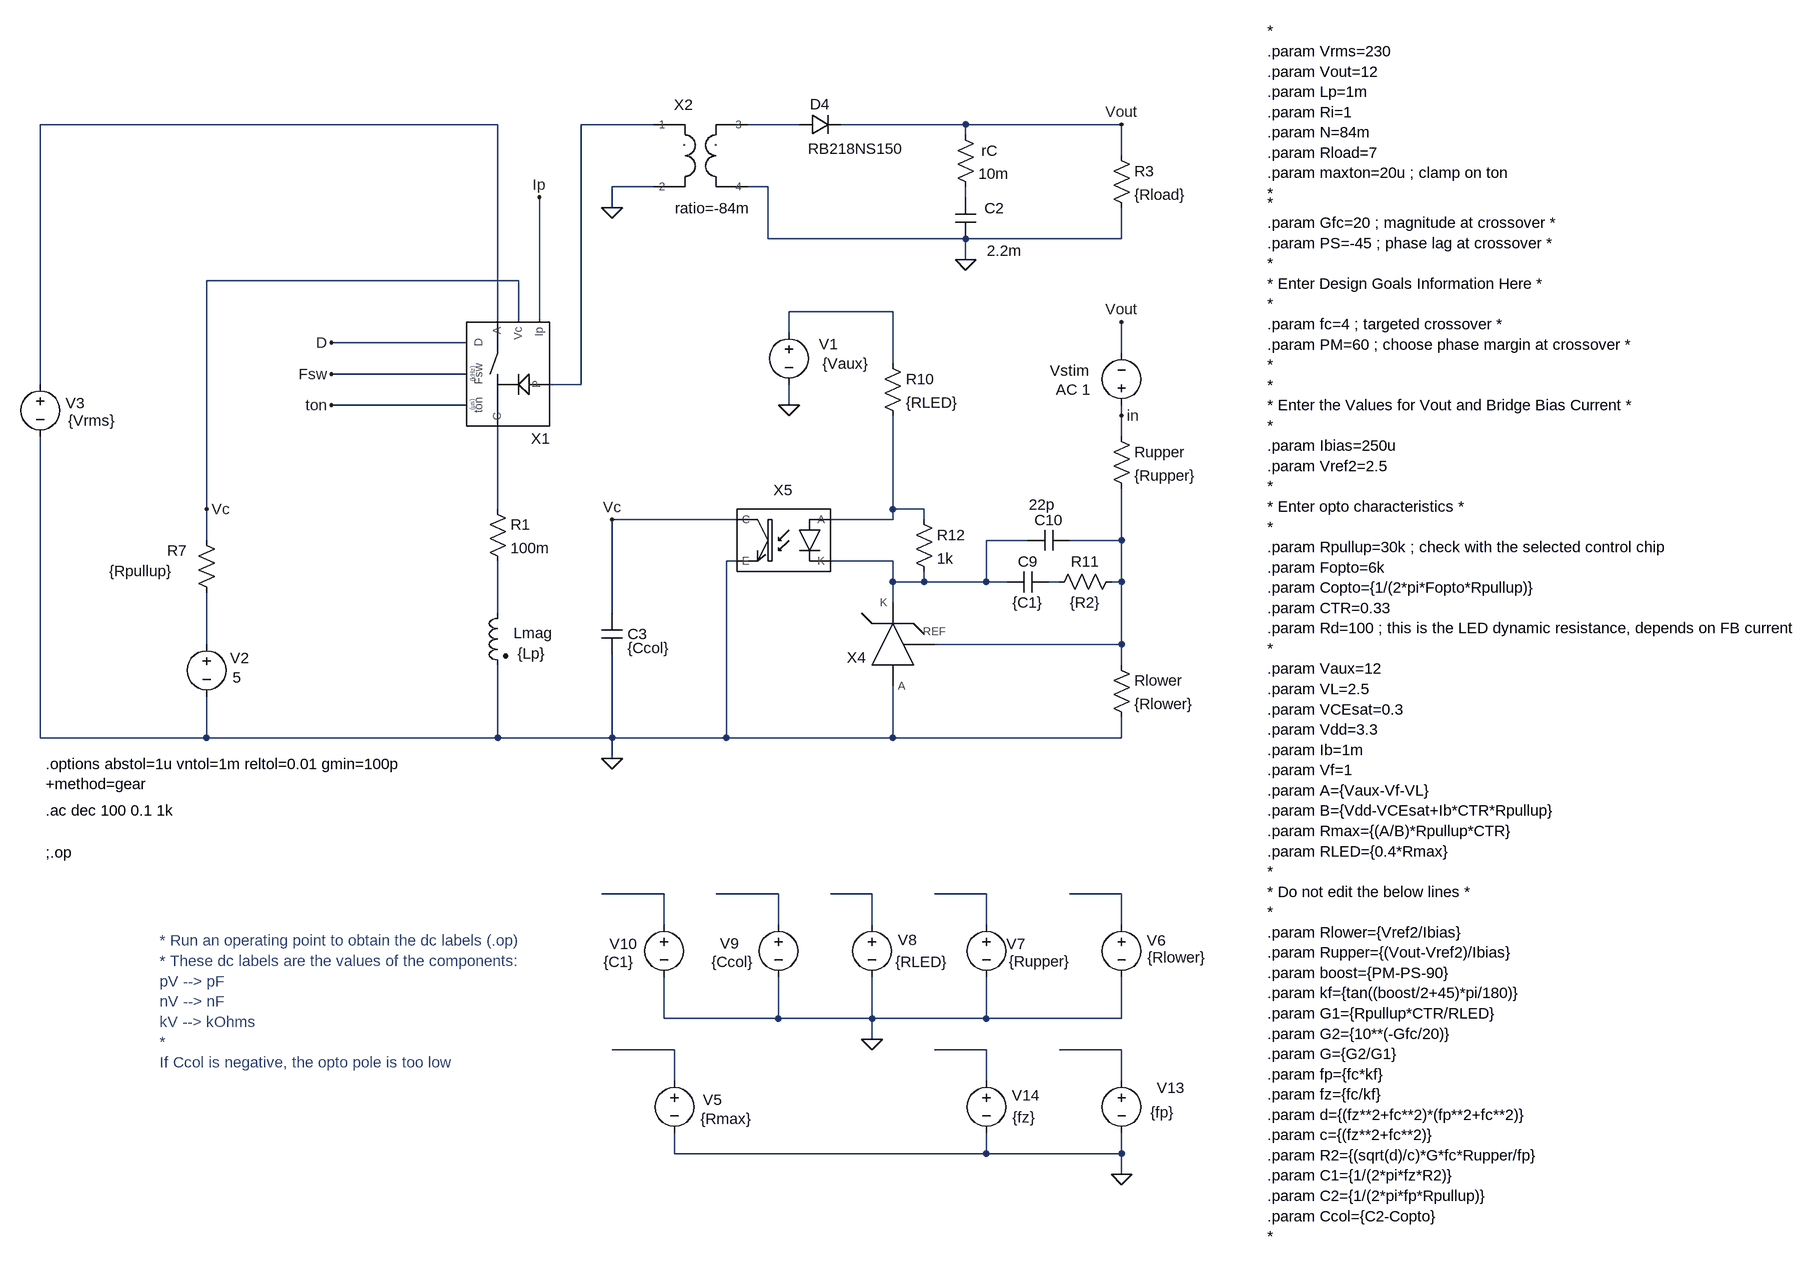
[diagram p0: schematic Flyback CM - QR - isolated single stage - averaged ac.asc]
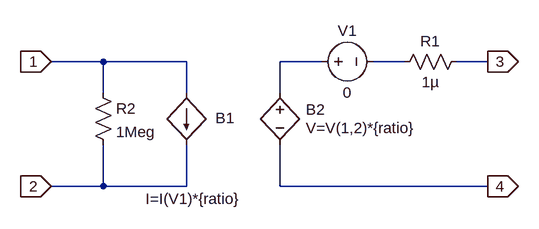
[diagram p1: sub-circuit xfmr.asc]
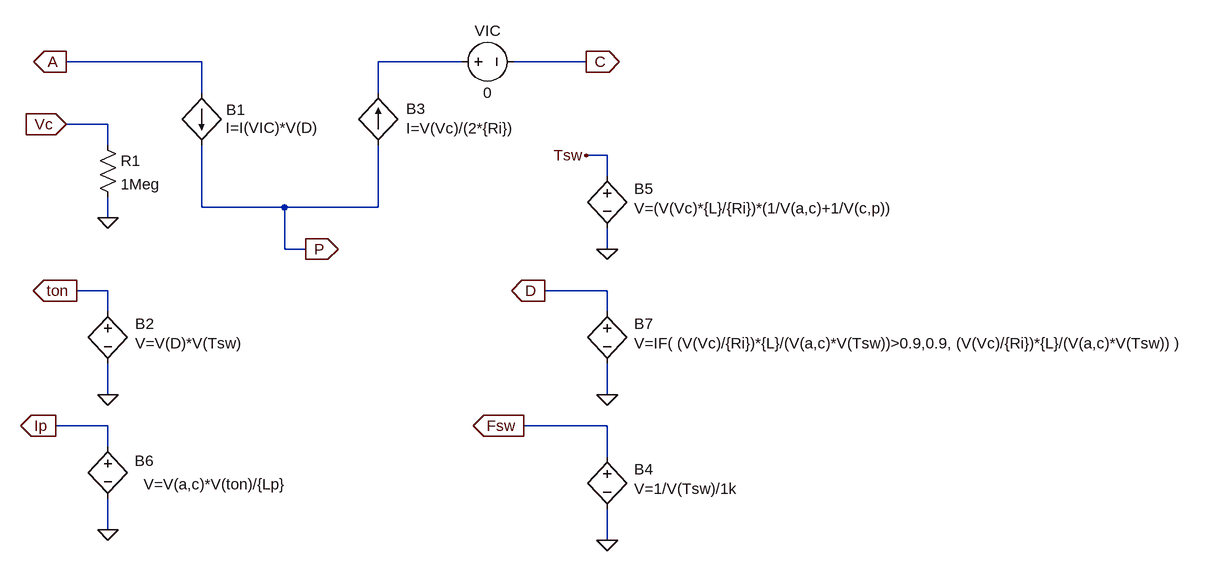
[diagram p2: sub-circuit pwmbcmcm.asc]
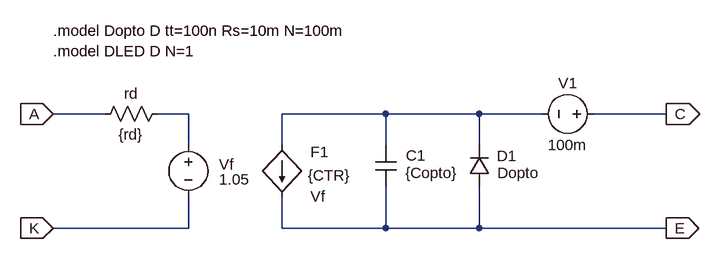
[diagram p3: sub-circuit optotof.asc]
Flyback CM - QR - isolated single stage - averaged ac.asc, the LTspice schematic file:
Version 4.1
SHEET 1 3452 1760
WIRE 16 -208 -688 -208
WIRE 256 -208 144 -208
WIRE 480 -208 400 -208
WIRE 736 -208 544 -208
WIRE 976 -208 736 -208
WIRE 736 -192 736 -208
WIRE 976 -160 976 -208
WIRE 256 -112 192 -112
WIRE 432 -112 400 -112
WIRE 736 -96 736 -112
WIRE 192 -80 192 -112
WIRE 432 -32 432 -112
WIRE 736 -32 432 -32
WIRE 976 -32 976 -80
WIRE 976 -32 736 -32
WIRE 736 0 736 -32
WIRE 48 32 -432 32
WIRE 624 80 464 80
WIRE 16 96 16 -208
WIRE 48 96 48 32
WIRE 80 96 80 -96
WIRE 464 112 464 80
WIRE -32 128 -240 128
WIRE 976 144 976 96
WIRE 624 160 624 80
WIRE -32 176 -240 176
WIRE -688 192 -688 -208
WIRE 144 192 144 -208
WIRE 144 192 96 192
WIRE -32 224 -240 224
WIRE 464 224 464 192
WIRE 976 240 976 224
WIRE 976 272 976 240
WIRE -432 384 -432 32
WIRE 16 384 16 256
WIRE 624 384 624 240
WIRE 672 384 624 384
WIRE 384 400 192 400
WIRE 624 400 624 384
WIRE 624 400 528 400
WIRE 672 400 672 384
WIRE -432 432 -432 384
WIRE 832 432 768 432
WIRE 976 432 976 352
WIRE 976 432 896 432
WIRE 384 464 368 464
WIRE 624 464 528 464
WIRE 624 496 624 464
WIRE 672 496 672 480
WIRE 672 496 624 496
WIRE 768 496 768 432
WIRE 768 496 672 496
WIRE 800 496 768 496
WIRE 880 496 864 496
WIRE 976 496 976 432
WIRE 976 496 960 496
WIRE 624 528 624 496
WIRE 16 544 16 464
WIRE 192 544 192 400
WIRE -432 592 -432 512
WIRE 976 592 976 496
WIRE 976 592 688 592
WIRE 976 624 976 592
WIRE -688 736 -688 272
WIRE -432 736 -432 672
WIRE -432 736 -688 736
WIRE 16 736 16 624
WIRE 16 736 -432 736
WIRE 192 736 192 608
WIRE 192 736 16 736
WIRE 368 736 368 464
WIRE 368 736 192 736
WIRE 624 736 624 656
WIRE 624 736 368 736
WIRE 976 736 976 704
WIRE 976 736 624 736
WIRE 192 768 192 736
WIRE 272 976 176 976
WIRE 448 976 352 976
WIRE 592 976 528 976
WIRE 768 976 688 976
WIRE 976 976 896 976
WIRE 272 1024 272 976
WIRE 448 1024 448 976
WIRE 592 1024 592 976
WIRE 768 1024 768 976
WIRE 976 1024 976 976
WIRE 272 1168 272 1104
WIRE 448 1168 448 1104
WIRE 448 1168 272 1168
WIRE 592 1168 592 1104
WIRE 592 1168 448 1168
WIRE 768 1168 768 1104
WIRE 768 1168 592 1168
WIRE 976 1168 976 1104
WIRE 976 1168 768 1168
WIRE 592 1200 592 1168
WIRE 288 1216 192 1216
WIRE 768 1216 688 1216
WIRE 976 1216 880 1216
WIRE 288 1264 288 1216
WIRE 768 1264 768 1216
WIRE 976 1264 976 1216
WIRE 288 1376 288 1344
WIRE 768 1376 768 1344
WIRE 768 1376 288 1376
WIRE 976 1376 976 1344
WIRE 976 1376 768 1376
WIRE 976 1408 976 1376
FLAG 736 0 0
FLAG 976 -208 Vout
FLAG 192 768 0
FLAG 592 1200 0
FLAG 976 1408 0
FLAG 192 400 Vc
FLAG 976 96 Vout
FLAG 464 224 0
FLAG 192 -80 0
FLAG -432 384 Vc
FLAG -240 128 D
FLAG -240 176 Fsw
FLAG -240 224 ton
FLAG 80 -96 Ip
FLAG 976 240 in
DATAFLAG 192 976 ""
DATAFLAG 384 976 ""
DATAFLAG 560 976 ""
DATAFLAG 704 976 ""
DATAFLAG 928 976 ""
DATAFLAG 896 1216 ""
DATAFLAG 736 1216 ""
DATAFLAG 208 1216 ""
DATAFLAG 736 -208 ""
DATAFLAG 304 400 ""
DATAFLAG 976 432 ""
DATAFLAG -176 128 ""
DATAFLAG -160 176 ""
DATAFLAG -144 224 ""
DATAFLAG 80 0 ""
SYMBOL ind2 32 528 M0
WINDOW 0 -69 47 Left 2
WINDOW 3 -58 78 Left 2
SYMATTR InstName Lmag
SYMATTR Value {Lp}
SYMATTR Type ind
SYMBOL res 720 -208 R0
WINDOW 0 40 40 Left 2
SYMATTR InstName rC
SYMATTR Value 10m
SYMBOL cap 720 -96 R0
WINDOW 0 45 17 Left 2
WINDOW 3 49 82 Left 2
WINDOW 123 45 45 Left 2
SYMATTR InstName C2
SYMATTR Value 2.2m
SYMBOL res 960 -176 R0
SYMATTR InstName R3
SYMATTR Value {Rload}
SYMBOL voltage 976 1008 R0
WINDOW 0 39 40 Left 2
WINDOW 3 40 66 Left 2
WINDOW 123 0 0 Left 0
WINDOW 39 0 0 Left 0
SYMATTR InstName V6
SYMATTR Value {Rlower}
SYMBOL voltage 768 1008 R0
WINDOW 0 31 45 Left 2
WINDOW 3 35 72 Left 2
WINDOW 123 0 0 Left 0
WINDOW 39 0 0 Left 0
SYMATTR InstName V7
SYMATTR Value {Rupper}
SYMBOL voltage 592 1008 R0
WINDOW 0 40 39 Left 2
WINDOW 3 36 73 Left 2
WINDOW 123 0 0 Left 0
WINDOW 39 0 0 Left 0
SYMATTR InstName V8
SYMATTR Value {RLED}
SYMBOL voltage 448 1008 R0
WINDOW 0 -90 44 Left 2
WINDOW 3 -103 73 Left 2
SYMATTR InstName V9
SYMATTR Value {Ccol}
SYMBOL voltage 272 1008 R0
WINDOW 0 -84 45 Left 2
WINDOW 3 -93 73 Left 2
WINDOW 123 0 0 Left 0
WINDOW 39 0 0 Left 0
SYMATTR InstName V10
SYMATTR Value {C1}
SYMBOL voltage 976 1248 R0
WINDOW 0 54 27 Left 2
WINDOW 3 44 64 Left 2
WINDOW 123 0 0 Left 0
WINDOW 39 0 0 Left 0
SYMATTR InstName V13
SYMATTR Value {fp}
SYMBOL voltage 768 1248 R0
WINDOW 0 39 38 Left 2
WINDOW 3 40 72 Left 2
SYMATTR InstName V14
SYMATTR Value {fz}
SYMBOL voltage -432 576 R0
WINDOW 0 36 37 Left 2
WINDOW 3 40 67 Left 2
SYMATTR InstName V2
SYMATTR Value 5
SYMBOL res -448 416 R0
WINDOW 3 -134 63 Left 2
WINDOW 0 -45 32 Left 2
SYMATTR Value {Rpullup}
SYMATTR InstName R7
SYMBOL cap 176 544 R0
WINDOW 0 40 32 Left 2
WINDOW 3 40 54 Left 2
SYMATTR InstName C3
SYMATTR Value {Ccol}
SYMBOL voltage 288 1248 R0
WINDOW 0 44 45 Left 2
WINDOW 3 40 74 Left 2
WINDOW 123 0 0 Left 0
WINDOW 39 0 0 Left 0
SYMATTR InstName V5
SYMATTR Value {Rmax}
SYMBOL diode 480 -192 R270
WINDOW 0 32 32 VTop 2
WINDOW 3 -6 87 VBottom 2
SYMATTR InstName D4
SYMATTR Value RB218NS150
SYMBOL res 960 608 R0
SYMATTR InstName Rlower
SYMATTR Value {Rlower}
SYMBOL res 960 256 R0
SYMATTR InstName Rupper
SYMATTR Value {Rupper}
SYMBOL res 608 144 R0
SYMATTR InstName R10
SYMATTR Value {RLED}
SYMBOL voltage 464 96 R0
WINDOW 0 46 34 Left 2
WINDOW 3 52 64 Left 2
SYMATTR InstName V1
SYMATTR Value {Vaux}
SYMBOL cap 800 480 M90
WINDOW 0 0 32 VBottom 2
WINDOW 3 32 32 VTop 2
WINDOW 123 60 32 VTop 2
SYMATTR InstName C9
SYMATTR Value {C1}
SYMBOL res 976 480 R90
WINDOW 0 0 56 VBottom 2
WINDOW 3 32 56 VTop 2
SYMATTR InstName R11
SYMATTR Value {R2}
SYMBOL cap 896 416 R90
WINDOW 0 0 32 VBottom 2
WINDOW 3 -55 42 VTop 2
SYMATTR InstName C10
SYMATTR Value 22p
SYMBOL res 656 384 R0
SYMATTR InstName R12
SYMATTR Value 1k
SYMBOL TOF\\Subcircuits\\XFMR 288 -192 R0
WINDOW 0 14 -31 Bottom 2
WINDOW 39 59 128 Bottom 2
SYMATTR InstName X2
SYMATTR SpiceLine ratio=-84m
SYMBOL res 0 368 R0
SYMATTR InstName R1
SYMATTR Value 100m
SYMBOL TOF\\Subcircuits\\PWMBCMCM 32 160 M90
WINDOW 0 131 50 VBottom 2
SYMATTR InstName X1
SYMATTR SpiceLine Ri={Ri} L={Lp} Maxton={maxton}
SYMBOL voltage -688 176 R0
WINDOW 0 39 45 Left 2
WINDOW 3 43 72 Left 2
SYMATTR InstName V3
SYMATTR Value {Vrms}
SYMBOL voltage 976 240 R180
WINDOW 0 50 69 Left 2
WINDOW 3 24 16 Left 2
WINDOW 123 48 40 Left 2
WINDOW 39 0 0 Left 0
SYMATTR InstName Vstim
SYMATTR Value ""
SYMATTR Value2 AC 1
SYMBOL TOF\\Subcircuits\\optoTOF 416 432 M0
SYMATTR InstName X5
SYMATTR SpiceLine Copto={Copto} Rd={Rd} CTR={CTR}
SYMBOL TOF\\Subcircuits\\TL431TOF 608 544 R0
WINDOW 0 -40 84 Bottom 2
SYMATTR InstName X4
TEXT -680 912 Left 2 !;.op
TEXT -680 776 Left 2 !.options abstol=1u vntol=1m reltol=0.01 gmin=100p\n+method=gear
TEXT -504 1048 Left 2 ;* Run an operating point to obtain the dc labels (.op)\n* These dc labels are the values of the components:\npV --> pF\nnV --> nF\nkV --> kOhms\n*\nIf Ccol is negative, the opto pole is too low
TEXT 1200 -352 Left 2 !*\n.param Vrms=230\n.param Vout=12\n.param Lp=1m\n.param Ri=1\n.param N=84m\n.param Rload=7\n.param maxton=20u ; clamp on ton\n*
TEXT 1200 -88 Left 2 !*\n.param Gfc=20 ; magnitude at crossover *\n.param PS=-45 ; phase lag at crossover *\n*\n* Enter Design Goals Information Here *\n*\n.param fc=4 ; targeted crossover *\n.param PM=60 ; choose phase margin at crossover *\n*\n*\n* Enter the Values for Vout and Bridge Bias Current *\n*\n.param Ibias=250u\n.param Vref2=2.5\n*\n* Enter opto characteristics *\n*\n.param Rpullup=30k ; check with the selected control chip\n.param Fopto=6k\n.param Copto={1/(2*pi*Fopto*Rpullup)}\n.param CTR=0.33\n.param Rd=100 ; this is the LED dynamic resistance, depends on FB current\n*\n.param Vaux=12\n.param VL=2.5\n.param VCEsat=0.3\n.param Vdd=3.3\n.param Ib=1m\n.param Vf=1\n.param A={Vaux-Vf-VL}\n.param B={Vdd-VCEsat+Ib*CTR*Rpullup}\n.param Rmax={(A/B)*Rpullup*CTR}\n.param RLED={0.4*Rmax}\n*\n* Do not edit the below lines *\n*\n.param Rlower={Vref2/Ibias}\n.param Rupper={(Vout-Vref2)/Ibias}\n.param boost={PM-PS-90}\n.param kf={tan((boost/2+45)*pi/180)}\n.param G1={Rpullup*CTR/RLED}\n.param G2={10**(-Gfc/20)}\n.param G={G2/G1}\n.param fp={fc*kf}\n.param fz={fc/kf}\n.param d={(fz**2+fc**2)*(fp**2+fc**2)}\n.param c={(fz**2+fc**2)}\n.param R2={(sqrt(d)/c)*G*fc*Rupper/fp}\n.param C1={1/(2*pi*fz*R2)}\n.param C2={1/(2*pi*fp*Rpullup)}\n.param Ccol={C2-Copto}\n*
TEXT -680 848 Left 2 !.ac dec 100 0.1 1k

xfmr.asc, the sub-circuit schematic file:
Version 4.1
SHEET 1 880 680
WIRE 32 96 -48 96
WIRE 160 96 32 96
WIRE 368 96 304 96
WIRE 496 96 448 96
WIRE 624 96 576 96
WIRE 32 144 32 96
WIRE 160 144 160 96
WIRE 304 144 304 96
WIRE 32 288 32 224
WIRE 32 288 -48 288
WIRE 160 288 160 224
WIRE 160 288 32 288
WIRE 304 288 304 224
WIRE 624 288 304 288
FLAG 624 288 4
IOPIN 624 288 Out
FLAG 624 96 3
IOPIN 624 96 Out
FLAG -48 96 1
IOPIN -48 96 In
FLAG -48 288 2
IOPIN -48 288 In
SYMBOL bi 160 144 R0
WINDOW 0 45 39 Left 2
WINDOW 3 -63 163 Left 2
SYMATTR InstName B1
SYMATTR Value I=I(V1)*{ratio}
SYMBOL bv 304 128 R0
WINDOW 0 40 42 Left 2
WINDOW 3 40 70 Left 2
SYMATTR InstName B2
SYMATTR Value V=V(1,2)*{ratio}
SYMBOL voltage 352 96 R270
WINDOW 0 32 56 VTop 2
WINDOW 3 -32 56 VBottom 2
WINDOW 123 0 0 Left 0
WINDOW 39 0 0 Left 0
SYMATTR InstName V1
SYMATTR Value 0
SYMBOL res 592 80 R90
WINDOW 0 0 56 VBottom 2
WINDOW 3 32 56 VTop 2
SYMATTR InstName R1
SYMATTR Value 1µ
SYMBOL res 16 128 R0
SYMATTR InstName R2
SYMATTR Value 1Meg

pwmbcmcm.asc, the sub-circuit schematic file:
Version 4.1
SHEET 1 2736 884
WIRE 336 -80 128 -80
WIRE 736 -80 608 -80
WIRE 928 -80 816 -80
WIRE 336 -32 336 -80
WIRE 608 -32 608 -80
WIRE 192 16 128 16
WIRE 192 48 192 16
WIRE 960 64 928 64
WIRE 960 96 960 64
WIRE 336 144 336 48
WIRE 464 144 336 144
WIRE 608 144 608 48
WIRE 608 144 464 144
WIRE 192 160 192 128
WIRE 464 208 464 144
WIRE 496 208 464 208
WIRE 960 208 960 176
WIRE 192 272 144 272
WIRE 960 272 864 272
WIRE 192 304 192 272
WIRE 960 304 960 272
WIRE 192 432 192 384
WIRE 960 432 960 384
WIRE 192 480 112 480
WIRE 960 480 832 480
WIRE 192 512 192 480
WIRE 960 528 960 480
WIRE 192 640 192 592
WIRE 960 656 960 608
FLAG 192 432 0
FLAG 128 -80 A
IOPIN 128 -80 Out
FLAG 928 -80 C
IOPIN 928 -80 Out
FLAG 496 208 P
IOPIN 496 208 Out
FLAG 144 272 ton
IOPIN 144 272 Out
FLAG 960 432 0
FLAG 864 272 D
IOPIN 864 272 Out
FLAG 832 480 Fsw
IOPIN 832 480 Out
FLAG 960 656 0
FLAG 192 160 0
FLAG 128 16 Vc
IOPIN 128 16 In
FLAG 960 208 0
FLAG 928 64 Tsw
FLAG 192 640 0
FLAG 112 480 Ip
IOPIN 112 480 Out
SYMBOL bi 336 -32 R0
WINDOW 0 38 26 Left 2
WINDOW 3 37 53 Left 2
SYMATTR InstName B1
SYMATTR Value I=I(VIC)*V(D)
SYMBOL bv 192 288 R0
WINDOW 0 42 35 Left 2
WINDOW 3 42 65 Left 2
SYMATTR InstName B2
SYMATTR Value V=V(D)*V(Tsw)
SYMBOL voltage 720 -80 R270
WINDOW 0 32 56 VTop 2
WINDOW 3 -32 56 VBottom 2
WINDOW 123 0 0 Left 0
WINDOW 39 0 0 Left 0
SYMATTR InstName VIC
SYMATTR Value 0
SYMBOL bi 608 48 M180
WINDOW 0 43 56 Left 2
WINDOW 3 43 26 Left 2
SYMATTR InstName B3
SYMATTR Value I=V(Vc)/(2*{Ri})
SYMBOL bv 960 512 R0
WINDOW 0 42 35 Left 2
WINDOW 3 42 65 Left 2
SYMATTR InstName B4
SYMATTR Value V=1/V(Tsw)/1k
SYMBOL res 176 32 R0
SYMATTR InstName R1
SYMATTR Value 1Meg
SYMBOL bv 960 80 R0
WINDOW 0 42 35 Left 2
WINDOW 3 42 65 Left 2
SYMATTR InstName B5
SYMATTR Value V=(V(Vc)*{L}/{Ri})*(1/V(a,c)+1/V(c,p))
SYMBOL bv 192 496 R0
WINDOW 0 41 38 Left 2
WINDOW 3 55 74 Left 2
SYMATTR InstName B6
SYMATTR Value V=V(a,c)*V(ton)/{Lp}
SYMBOL bv 960 288 R0
WINDOW 0 42 35 Left 2
WINDOW 3 42 65 Left 2
SYMATTR InstName B7
SYMATTR Value V=IF( (V(Vc)/{Ri})*{L}/(V(a,c)*V(Tsw))>0.9,0.9, (V(Vc)/{Ri})*{L}/(V(a,c)*V(Tsw)) )

optotof.asc, the sub-circuit schematic file:
Version 4
SHEET 1 892 680
WIRE -48 32 -128 32
WIRE 80 32 32 32
WIRE 384 32 224 32
WIRE 528 32 384 32
WIRE 624 32 528 32
WIRE 816 32 704 32
WIRE 80 80 80 32
WIRE 224 80 224 32
WIRE 384 80 384 32
WIRE 528 80 528 32
WIRE 80 208 80 160
WIRE 80 208 -128 208
WIRE 224 208 224 160
WIRE 384 208 384 144
WIRE 384 208 224 208
WIRE 528 208 528 144
WIRE 528 208 384 208
WIRE 816 208 528 208
FLAG -128 32 A
IOPIN -128 32 In
FLAG -128 208 K
IOPIN -128 208 In
FLAG 816 32 C
IOPIN 816 32 Out
FLAG 816 208 E
IOPIN 816 208 Out
SYMBOL f 224 80 R0
WINDOW 0 44 11 Left 2
WINDOW 3 40 47 Left 2
WINDOW 38 44 79 Left 2
SYMATTR InstName F1
SYMATTR Value {CTR}
SYMATTR SpiceModel Vf
SYMBOL res 48 16 R90
WINDOW 0 0 56 VBottom 2
WINDOW 3 32 56 VTop 2
SYMATTR InstName rd
SYMATTR Value {rd}
SYMBOL voltage 80 64 R0
WINDOW 0 47 46 Left 2
WINDOW 3 47 69 Left 2
WINDOW 123 0 0 Left 0
WINDOW 39 0 0 Left 0
SYMATTR InstName Vf
SYMATTR Value 1.05
SYMBOL voltage 720 32 R90
WINDOW 0 -32 56 VBottom 2
WINDOW 3 32 56 VTop 2
SYMATTR InstName V1
SYMATTR Value 100m
SYMBOL cap 368 80 R0
WINDOW 0 47 16 Left 2
WINDOW 3 46 43 Left 2
SYMATTR InstName C1
SYMATTR Value {Copto}
SYMBOL diode 512 144 M180
WINDOW 0 43 47 Left 2
WINDOW 3 44 21 Left 2
SYMATTR InstName D1
SYMATTR Value Dopto
TEXT -128 -96 Left 2 !.model Dopto D tt=100n Rs=10m N=100m\n.model DLED D N=1

The netlist it stands for:
* Flyback CM - QR - isolated single stage - averaged ac.asc
Lmag N011 0 {Lp}
rC Vout N004 10m
C2 N004 0 2.2m
R3 Vout 0 {Rload}
V6 N017 0 {Rlower}
V7 N016 0 {Rupper}
V8 N015 0 {RLED}
V9 N014 0 {Ccol}
V10 N013 0 {C1}
V13 N020 0 {fp}
V14 N019 0 {fz}
V2 N012 0 5
R7 Vc N012 {Rpullup}
C3 Vc 0 {Ccol}
V5 N018 0 {Rmax}
D4 N003 Vout RB218NS150
Rlower N009 0 {Rlower}
Rupper in N009 {Rupper}
R10 N005 N007 {RLED}
V1 N005 0 {Vaux}
C9 N008 N010 {C1}
R11 N009 N010 {R2}
C10 N009 N008 22p
R12 N007 N008 1k
X§X2 N002 0 N003 0 xfmr params: ratio=-84m
R1 N006 N011 100m
X§X1 Vc N001 N006 N002 ton Fsw D Ip pwmbcmcm params: Ri={Ri} L={Lp} Maxton={maxton}
V3 N001 0 {Vrms}
Vstim in Vout AC 1
X§X5 N007 N008 Vc 0 optotof params: Copto={Copto} Rd={Rd} CTR={CTR}
X§X4 0 N009 N008 TL431TOF  ; pins A REF K

* block symbol definitions
.subckt xfmr 1 2 3 4
B1 1 2 I=I(V1)*{ratio}
B2 N001 4 V=V(1,2)*{ratio}
V1 N001 N002 0
R1 3 N002 1µ
R2 1 2 1Meg
.ends xfmr

.subckt pwmbcmcm Vc A C P ton Fsw D Ip
B1 A P I=I(VIC)*V(D)
B2 ton 0 V=V(D)*V(Tsw)
VIC N001 C 0
B3 P N001 I=V(Vc)/(2*{Ri})
B4 Fsw 0 V=1/V(Tsw)/1k
R1 Vc 0 1Meg
B5 Tsw 0 V=(V(Vc)*{L}/{Ri})*(1/V(a,c)+1/V(c,p))
B6 Ip 0 V=V(a,c)*V(ton)/{Lp}
B7 D 0 V=IF( (V(Vc)/{Ri})*{L}/(V(a,c)*V(Tsw))>0.9,0.9, (V(Vc)/{Ri})*{L}/(V(a,c)*V(Tsw)) )
.ends pwmbcmcm

.subckt optotof A K C E
F1 N002 E Vf {CTR}
rd N001 A {rd}
Vf N001 K 1.05
V1 C N002 100m
C1 N002 E {Copto}
D1 E N002 Dopto
.model Dopto D tt=100n Rs=10m N=100m
.model DLED D N=1
.ends optotof

.model D D
.lib standard.dio
;.op
.options abstol=1u vntol=1m reltol=0.01 gmin=100p
+method=gear
* * Run an operating point to obtain the dc labels (.op)
* * These dc labels are the values of the components:
* pV --> pF
* nV --> nF
* kV --> kOhms
* *
* If Ccol is negative, the opto pole is too low
*
.param Vrms=230
.param Vout=12
.param Lp=1m
.param Ri=1
.param N=84m
.param Rload=7
.param maxton=20u ; clamp on ton
*
*
.param Gfc=20 ; magnitude at crossover *
.param PS=-45 ; phase lag at crossover *
*
* Enter Design Goals Information Here *
*
.param fc=4 ; targeted crossover *
.param PM=60 ; choose phase margin at crossover *
*
*
* Enter the Values for Vout and Bridge Bias Current *
*
.param Ibias=250u
.param Vref2=2.5
*
* Enter opto characteristics *
*
.param Rpullup=30k ; check with the selected control chip
.param Fopto=6k
.param Copto={1/(2*pi*Fopto*Rpullup)}
.param CTR=0.33
.param Rd=100 ; this is the LED dynamic resistance, depends on FB current
*
.param Vaux=12
.param VL=2.5
.param VCEsat=0.3
.param Vdd=3.3
.param Ib=1m
.param Vf=1
.param A={Vaux-Vf-VL}
.param B={Vdd-VCEsat+Ib*CTR*Rpullup}
.param Rmax={(A/B)*Rpullup*CTR}
.param RLED={0.4*Rmax}
*
* Do not edit the below lines *
*
.param Rlower={Vref2/Ibias}
.param Rupper={(Vout-Vref2)/Ibias}
.param boost={PM-PS-90}
.param kf={tan((boost/2+45)*pi/180)}
.param G1={Rpullup*CTR/RLED}
.param G2={10**(-Gfc/20)}
.param G={G2/G1}
.param fp={fc*kf}
.param fz={fc/kf}
.param d={(fz**2+fc**2)*(fp**2+fc**2)}
.param c={(fz**2+fc**2)}
.param R2={(sqrt(d)/c)*G*fc*Rupper/fp}
.param C1={1/(2*pi*fz*R2)}
.param C2={1/(2*pi*fp*Rpullup)}
.param Ccol={C2-Copto}
*
.ac dec 100 0.1 1k
.backanno
.end